# EAGLE design openfc (EAGLE 6.2)
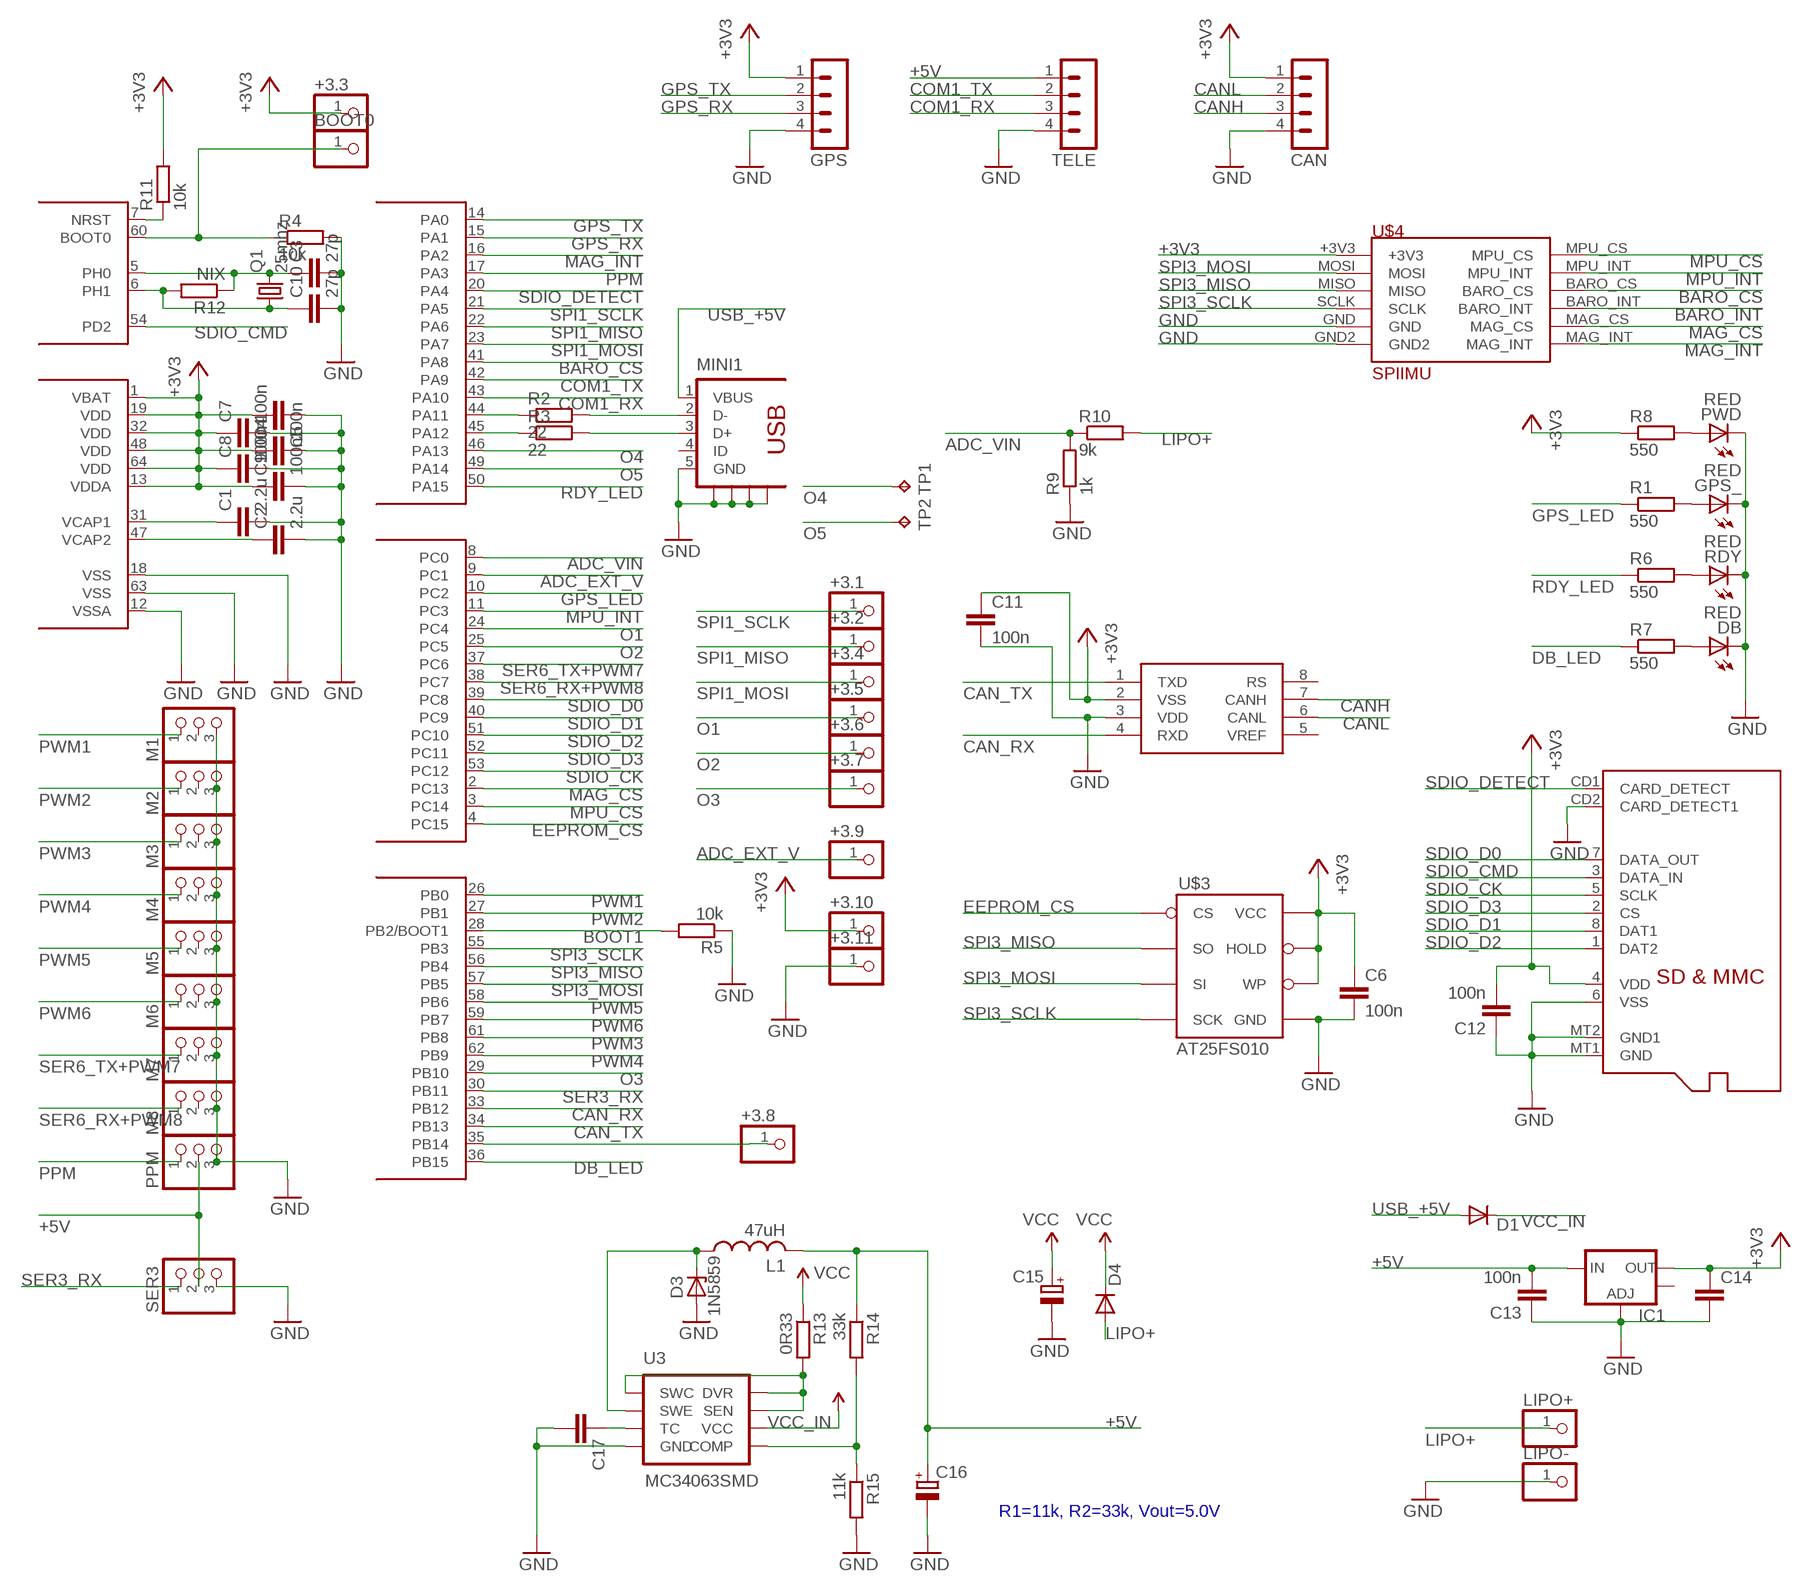
[diagram p0: schematic, sheet 1]

## Parts
+3.1  PINHD-1X1  [1X01]
+3.2  PINHD-1X1  [1X01]
+3.3  PINHD-1X1  [1X01]
+3.4  PINHD-1X1  [1X01]
+3.5  PINHD-1X1  [1X01]
+3.6  PINHD-1X1  [1X01]
+3.7  PINHD-1X1  [1X01]
+3.8  PINHD-1X1  [1X01]
+3.9  PINHD-1X1  [1X01]
+3.10  PINHD-1X1  [1X01]
+3.11  PINHD-1X1  [1X01]
BOOT0  PINHD-1X1  [1X01]
C1  2.2u  C-EUC0603  [C0603]
C2  2.2u  C-EUC0603  [C0603]
C3  27p  C-EUC0603  [C0603]
C4  100n  C-EUC0603  [C0603]
C5  100n  C-EUC0603  [C0603]
C6  100n  C-EUC0603  [C0603]
C7  100n  C-EUC0603  [C0603]
C8  100n  C-EUC0603  [C0603]
C9  100n  C-EUC0603  [C0603]
C10  27p  C-EUC0603  [C0603]
C11  100n  C-EUC0603  [C0603]
C12  100n  C-EUC0603  [C0603]
C13  100n  C-EUC0603  [C0603]
C14  C-EUC1206  [C1206]
C15  CPOL-EUB/3528-21R  [B/3528-21R]
C16  CPOL-EUB/3528-21R  [B/3528-21R]
C17  C-EUC0603  [C0603]
CAN  MA04-1  [MA04-1]
D1  DIODE-SMB  [SMB]
D3  1N5859  ZENER-DIODESMB  [SMB]
D4  DIODE-SMB  [SMB]
DB  RED  LED-RED0603  [LED-0603]
GPS  MA04-1  [MA04-1]
GPS_  RED  LED-RED0603  [LED-0603]
IC1  V_REG_LM1117SOT223  [SOT223]
L1  47uH  L-USL1812  [L1812]
LIPO+  PINHD-1X1  [1X01]
LIPO-  PINHD-1X1  [1X01]
M1  PINHD-1X3  [1X03]
M2  PINHD-1X3  [1X03]
M3  PINHD-1X3  [1X03]
M4  PINHD-1X3  [1X03]
M5  PINHD-1X3  [1X03]
M6  PINHD-1X3  [1X03]
M7  PINHD-1X3  [1X03]
M8  PINHD-1X3  [1X03]
MINI1  USB-5P  [USB-MINI-B]
PPM  PINHD-1X3  [1X03]
PWD  RED  LED-RED0603  [LED-0603]
Q1  25mhz  CRYSTALCTS406  [CTS406]
R1  550  R-EU_R0603  [R0603]
R2  22  R-EU_R0603  [R0603]
R3  22  R-EU_R0603  [R0603]
R4  10k  R-EU_R0603  [R0603]
R5  10k  R-EU_R0603  [R0603]
R6  550  R-EU_R0603  [R0603]
R7  550  R-EU_R0603  [R0603]
R8  550  R-EU_R0603  [R0603]
R9  1k  R-EU_R0603  [R0603]
R10  9k  R-EU_R0603  [R0603]
R11  10k  R-EU_R0603  [R0603]
R12  NIX  R-EU_R0603  [R0603]
R13  0R33  R-EU_R0603  [R0603]
R14  33k  R-EU_R0603  [R0603]
R15  11k  R-EU_R0603  [R0603]
RDY  RED  LED-RED0603  [LED-0603]
SER3  PINHD-1X3  [1X03]
TELE  MA04-1  [MA04-1]
TP1  TPTP14SQ  [TP14SQ]
TP2  TPTP14SQ  [TP14SQ]
U1  STM32F4-64  [SQFP-S-10X10-64]
U3  MC34063SMD  [SO08]
U4  MCP2551  [SO08]
U$2  MICROSD  [MICROSD]
U$3  AT25FS010  [SO08WIDE]
U$4  SPIIMU  [SPIIMU]

## Nets
+3V3: +3.3.1 +3.10.1 C4.1 C5.2 C6.1 C7.1 C8.1 C9.1 C11.1 C12.2 C14.1 CAN.1 GPS.1 IC1.2(OUT) R8.1 R11.2 U1.1(VBAT) U1.13(VDDA) U1.19(VDD) U1.32(VDD) U1.48(VDD) U1.64(VDD) U4.2(VSS) U$2.4(VDD) U$3.3(WP) U$3.7(HOLD) U$3.8(VCC) U$4.+3V3
+5V: C13.2 C16.+ IC1.3(IN) L1.2 PPM.2 R14.1 SER3.2 TELE.1
ADC_EXT_V: +3.9.1 U1.9(PC1)
ADC_VIN: R9.2 R10.1 U1.8(PC0)
BARO_CS: U1.41(PA8) U$4.BARO_CS
BARO_INT: U$4.BARO_INT
BOOT0: BOOT0.1 R4.1 U1.60(BOOT0)
BOOT1: R5.2 U1.28(PB2/BOOT1)
CAN_RX: U1.33(PB12) U4.4(RXD)
CAN_TX: U1.34(PB13) U4.1(TXD)
CANH: CAN.3 U4.7(CANH)
CANL: CAN.2 U4.6(CANL)
COM1_RX: TELE.3 U1.43(PA10)
COM1_TX: TELE.2 U1.42(PA9)
DB_LED: R7.1 U1.36(PB15)
EEPROM_CS: U1.4(PC15) U$3.1(CS)
GND: +3.11.1 C1.2 C2.2 C3.2 C4.2 C5.1 C6.2 C7.2 C8.2 C9.2 C10.2 C11.2 C12.1 C13.1 C14.2 C15.- C16.- C17.2 CAN.4 D3.A DB.C GPS.4 GPS_.C IC1.1(ADJ) LIPO-.1 M1.3 M2.3 M3.3 M4.3 M5.3 M6.3 M7.3 M8.3 MINI1.5(GND) MINI1.S1 MINI1.S2 MINI1.S3 MINI1.S4 PPM.3 PWD.C R4.2 R5.1 R9.1 R15.2 RDY.C SER3.3 TELE.4 U1.12(VSSA) U1.18(VSS) U1.63(VSS) U3.4(GND) U4.3(VDD) U$2.6(VSS) U$2.CD2(CARD_DETECT1) U$2.MT1(GND) U$2.MT2(GND1) U$3.4(GND) U$4.GND U$4.GND2
GPS_LED: R1.1 U1.10(PC2)
GPS_RX: GPS.3 U1.15(PA1)
GPS_TX: GPS.2 U1.14(PA0)
LIPO+: D4.A LIPO+.1 R10.2
MAG_CS: U1.2(PC13) U$4.MAG_CS
MAG_INT: U1.16(PA2) U$4.MAG_INT
MPU_CS: U1.3(PC14) U$4.MPU_CS
MPU_INT: U1.11(PC3) U$4.MPU_INT
N$1: C2.1 U1.47(VCAP2)
N$2: C1.1 U1.31(VCAP1)
N$3: R11.1 U1.7(NRST)
N$4: PWD.A R8.2
N$5: GPS_.A R1.2
N$6: R6.2 RDY.A
N$7: DB.A R7.2
N$8: +3.8.1 U1.35(PB14)
N$9: C3.1 Q1.3 R12.1 U1.5(PH0)
N$10: C10.1 Q1.1 R12.2 U1.6(PH1)
N$13: R2.1 U1.44(PA11)
N$14: R3.1 U1.45(PA12)
N$15: MINI1.2(D-) R2.2
N$16: MINI1.3(D+) R3.2
N$17: C17.1 U3.3(TC)
N$18: D3.C L1.1 U3.2(SWE)
N$19: R14.2 R15.1 U3.5(COMP)
N$20: R13.2 U3.1(SWC) U3.7(SEN) U3.8(DVR)
O1: +3.5.1 U1.24(PC4)
O2: +3.6.1 U1.25(PC5)
O3: +3.7.1 U1.29(PB10)
O4: TP1.TP U1.46(PA13)
O5: TP2.TP U1.49(PA14)
PPM: PPM.1 U1.17(PA3)
PWM1: M1.1 U1.26(PB0)
PWM2: M2.1 U1.27(PB1)
PWM3: M3.1 U1.61(PB8)
PWM4: M4.1 U1.62(PB9)
PWM5: M5.1 U1.58(PB6)
PWM6: M6.1 U1.59(PB7)
RDY_LED: R6.1 U1.50(PA15)
SDIO_CK: U1.53(PC12) U$2.5(SCLK)
SDIO_CMD: U1.54(PD2) U$2.3(DATA_IN)
SDIO_D0: U1.39(PC8) U$2.7(DATA_OUT)
SDIO_D1: U1.40(PC9) U$2.8(DAT1)
SDIO_D2: U1.51(PC10) U$2.1(DAT2)
SDIO_D3: U1.52(PC11) U$2.2(CS)
SDIO_DETECT: U1.20(PA4) U$2.CD1(CARD_DETECT)
SER3_RX: SER3.1 U1.30(PB11)
SER6_RX+PWM8: M8.1 U1.38(PC7)
SER6_TX+PWM7: M7.1 U1.37(PC6)
SPI1_MISO: +3.2.1 U1.22(PA6)
SPI1_MOSI: +3.4.1 U1.23(PA7)
SPI1_SCLK: +3.1.1 U1.21(PA5)
SPI3_MISO: U1.56(PB4) U$3.2(SO) U$4.MISO
SPI3_MOSI: U1.57(PB5) U$3.5(SI) U$4.MOSI
SPI3_SCLK: U1.55(PB3) U$3.6(SCK) U$4.SCLK
USB_+5V: D1.A MINI1.1(VBUS)
VCC_IN: C15.+ D1.C D4.C R13.1 U3.6(VCC) ; supply symbol labelled VCC
Unconnected: IC1.4(OUT) M1.2 M2.2 M3.2 M4.2 M5.2 M6.2 M7.2 M8.2 MINI1.4(ID) U4.5(VREF) U4.8(RS)

## Notes on the sheet
- R1=11k, R2=33k, Vout=5.0V

## Library data of the parts
+3.1-+3.11 BOOT0 LIPO+ LIPO- = adafruit:PINHD-1X1: Pin header 1x1 for 0.1" spacing With round pins
C1-C14 C17 = rcl:C-EU: CAPACITOR, European symbol
C15 C16 = rcl:CPOL-EU: POLARIZED CAPACITOR, European symbol
CAN GPS TELE = con-lstb:MA04-1: PIN HEADER; OC_FARNELL: unknown; OC_NEWARK: unknown
D1 D4 = diode:DIODE-: DIODE
D3 = diode:ZENER-DIODE: Z-Diode
DB GPS_ PWD RDY = SparkFun-LED:LED-RED: Assorted Red LEDs LilyPad 1206- DIO-09912 1206- DIO-00809 0603- DIO-00819; PROD_ID: DIO-00819
IC1 = SparkFun-PowerIC:V_REG_LM1117: Voltage Regulator LM1117 Standard adjustable voltage regulator but in SMD form. Spark Fun Electronics SKU : COM-00595
L1 = rcl:L-US: INDUCTOR, American symbol
M1-M8 PPM SER3 = adafruit:PINHD-1X3: PIN HEADER
MINI1 = BaseApp:USB-5P
Q1 = crystal:CRYSTAL: CRYSTAL; OC_FARNELL: unknown; OC_NEWARK: unknown
R1-R15 = resistor:R-EU_: RESISTOR, European symbol
TP1 TP2 = testpad:TP: Test pad
U1 = apbteam_stm32:STM32F4-64: STM32F4, 64 pin package According to STM32F40x datasheet, compatible with STM32F4xx, STM32F2xx. Also compatible with STM32F10x, if VCAP1 and VCAP2 are connected directly to VSS.
U3 = SparkFun:MC34063
U4 = SparkFun-DigitalIC:MCP2551: CAN transceiver
U$2 = adafruit:MICROSD: Micro-SD / Transflash card holder with SPI pinout For the 3M # 2908-05WB-MG and/or 4UCON #19656 push-push type
U$3 = SparkFun-DigitalIC:AT25FS010: 1-Mbit SPI flash memory
U$4 = spiimu:SPIIMU

## Board
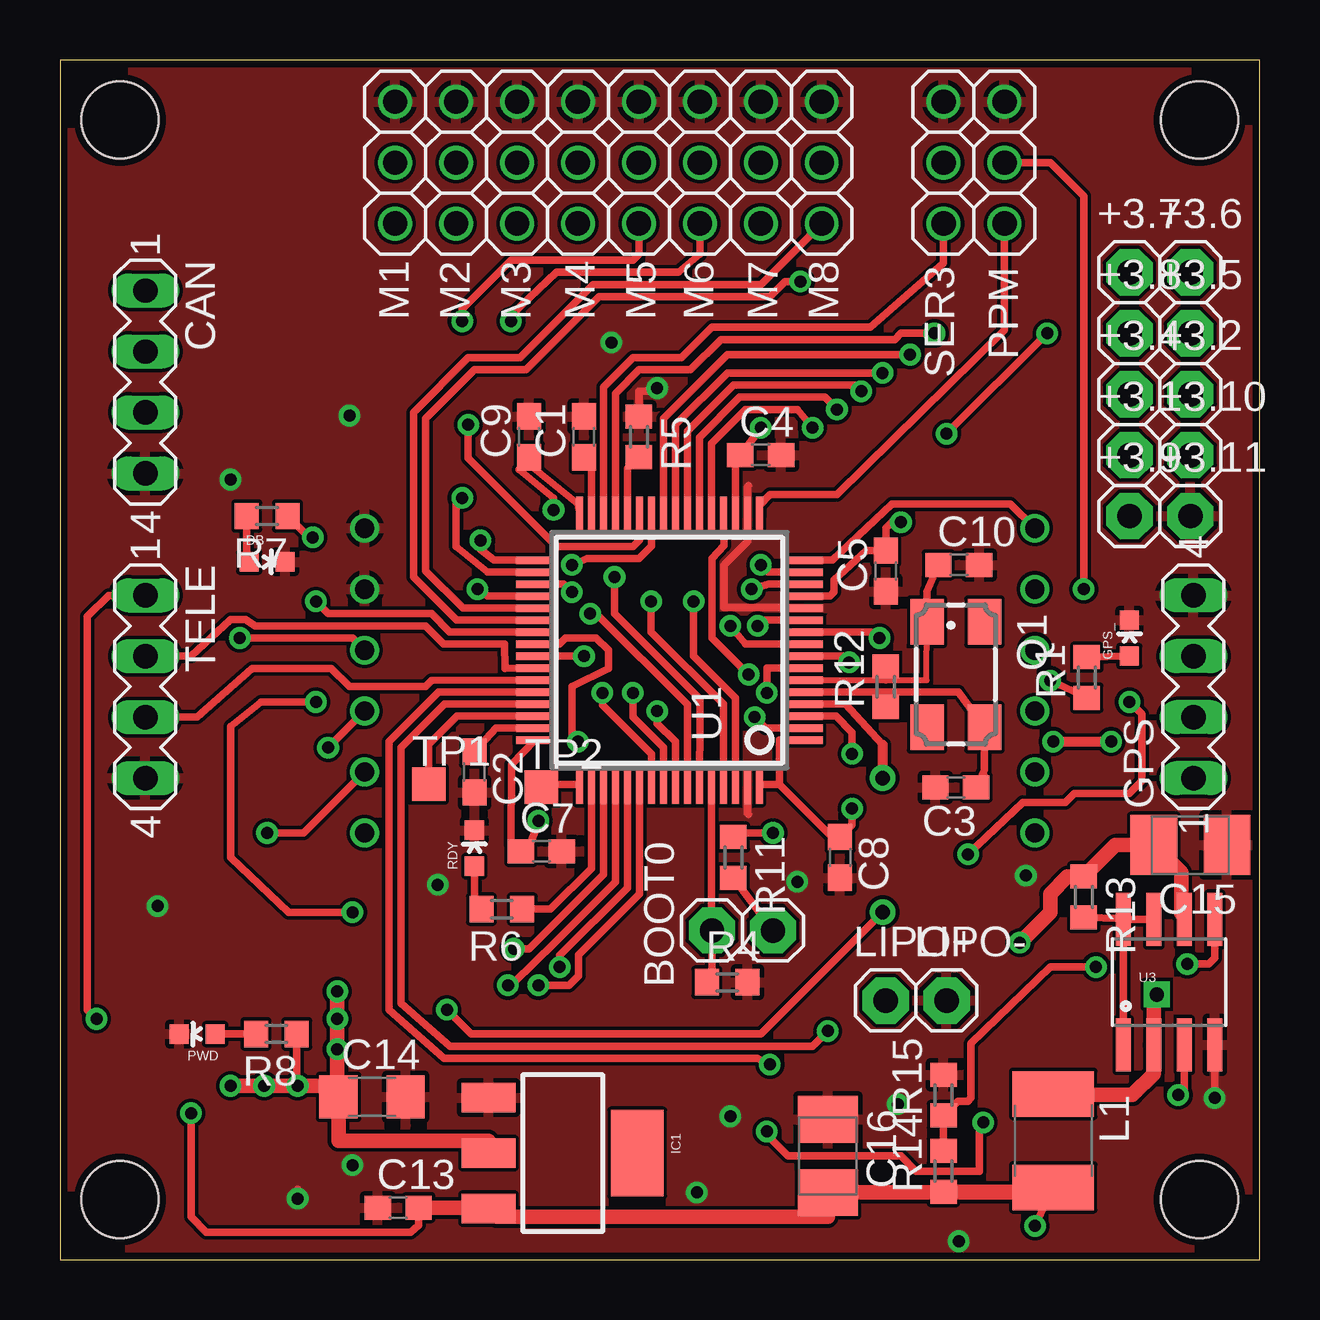
[diagram p1: board, top side]
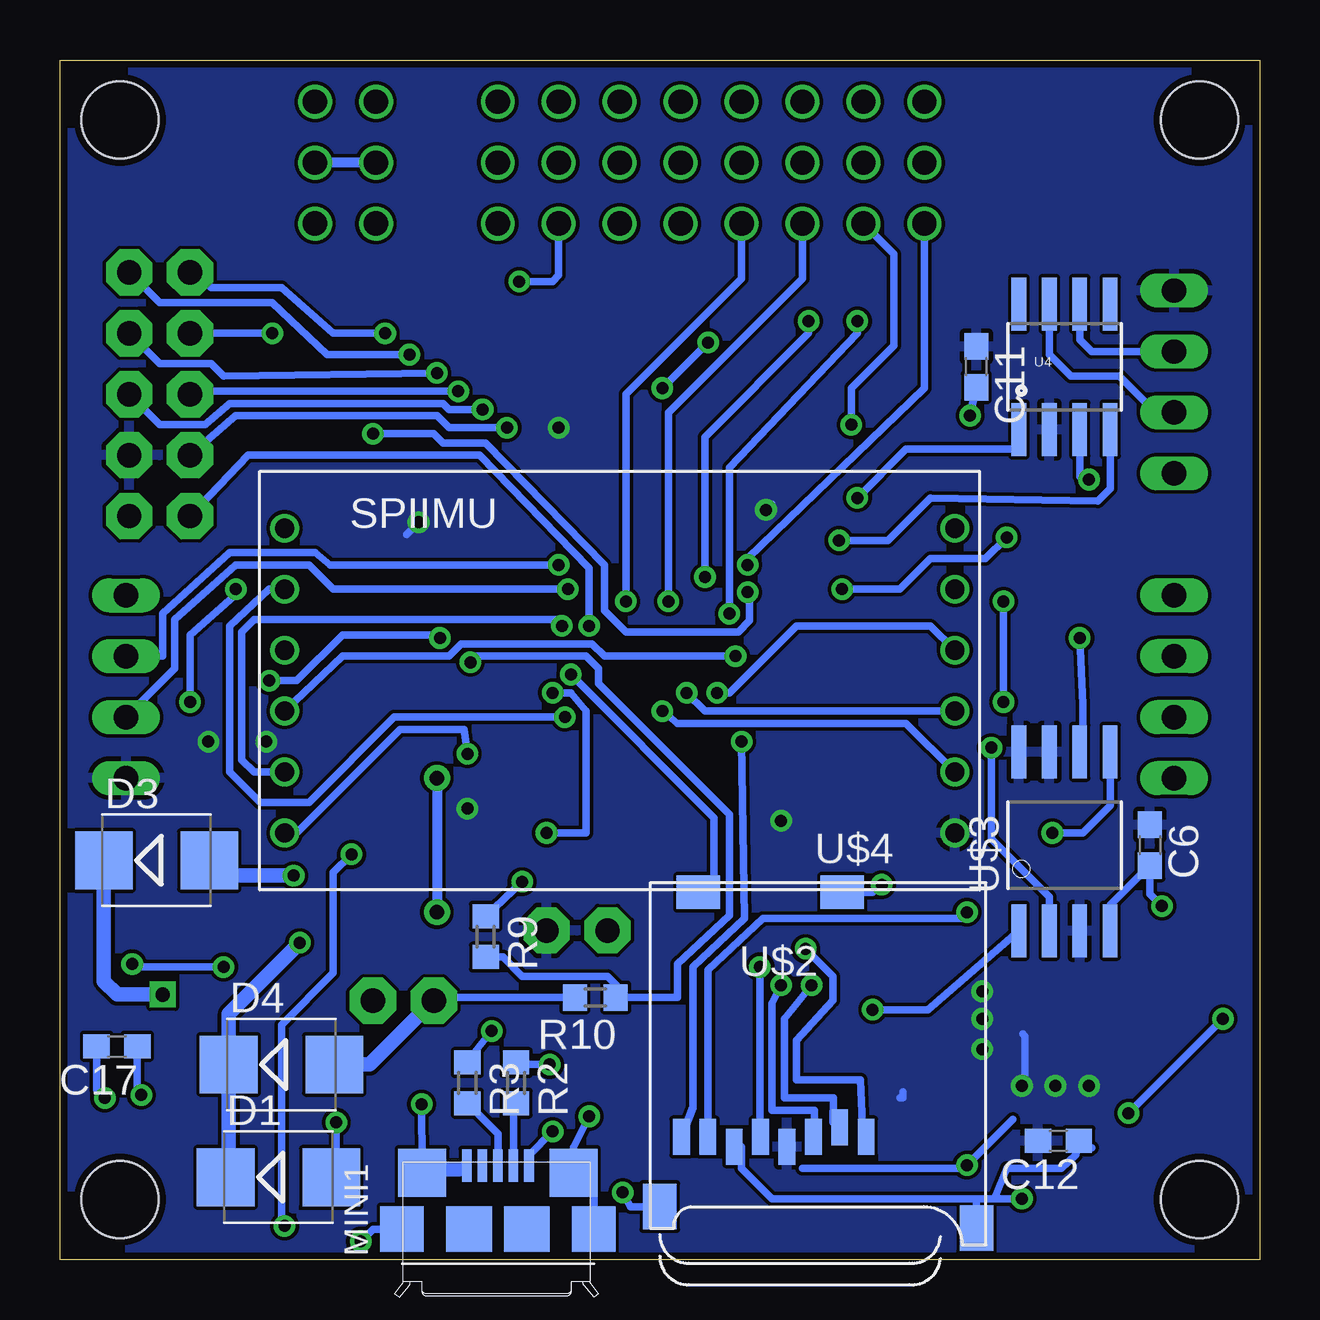
[diagram p2: board, bottom side, seen from below]

Size 50 x 50 mm. Coordinates in mm from the lower left corner, seen from the top.
Outline: 0,0 50,0 50,50 0,50 0,0
Copper layers (1*16): Top 0.035mm / dielectric 1.5mm / Bottom 0.035mm
Design rules: minimum track width 0.15mm, minimum drill 0.3mm, track to track 0.15mm, track to pad 0.15mm, pad to pad 0.15mm, via to via 0.15mm, smd to smd 0.15mm, copper to edge 0.3mm, drill to drill 0.2mm, minimum pad ring 0.2mm, minimum via ring 0.15mm, stop-mask expansion 0.075mm, vias tented up to drill 0mil, thermal gap 0.2mm
Holes 3.2 mm at 2.5,47.5 47.5,47.5 47.5,2.5 2.5,2.5

### Footprints (pad centres in the part's own frame; a part is rotated, then mirrored left to right if it is on the bottom)
1X01 = drill 1.016 pad 1.93 octagon: 1 0,0
C0603 = smd 1.1 x 1: 1 -0.85,0; 2 0.85,0
C1206 = smd 1.6 x 1.8: 1 -1.4,0; 2 1.4,0
B/3528-21R = smd 1.95 x 2.5: + 1.525,0; - -1.525,0
MA04-1 = drill 1.016 long: 1 -3.81,0; 2 -1.27,0; 3 1.27,0; 4 3.81,0
SMB = smd 2.4 x 2.4: A 2.2,0; C -2.2,0
LED-0603 = smd 0.8 x 0.8: A 0,-0.75; C 0,0.75
SOT223 = smd 1.219 x 2.235: 1 -2.311,-3.099; 2 0,-3.099; 3 2.311,-3.099 | smd 3.6 x 2.2: 4 0,3.099
L1812 = smd 1.9 x 3.4: 1 -1.95,0; 2 1.95,0
1X03 = drill 1.016: 1 -2.54,0; 2 0,0; 3 2.54,0
USB-MINI-B = smd 0.4 x 1.35: 1 1.3,2.65; 2 0.65,2.65; 3 0,2.65; 4 -0.65,2.65; 5 -1.3,2.65 | smd 1.9 x 1.9: M1 -1.2,0; M2 1.2,0 | smd 1.8 x 1.9: S1 -4,0; S2 4,0 | smd 2 x 2: S3 -3.15,2.35; S4 3.15,2.35
CTS406 = smd 1.9 x 1.4: 1 -2.2,-1.2; 2 2.2,-1.2; 3 2.2,1.2; 4 -2.2,1.2
R0603 = smd 1 x 1.1: 1 -0.85,0; 2 0.85,0
TP14SQ = smd 1.4 x 1.4: TP 0,0
SQFP-S-10X10-64 = smd 0.3 x 1.6: 1 -3.75,-5.6; 2 -3.25,-5.6; 3 -2.75,-5.6; 4 -2.25,-5.6; 5 -1.75,-5.6; 6 -1.25,-5.6; 7 -0.75,-5.6; 8 -0.25,-5.6; 9 0.25,-5.6; 10 0.75,-5.6; 11 1.25,-5.6; 12 1.75,-5.6; 13 2.25,-5.6; 14 2.75,-5.6; 15 3.25,-5.6; 16 3.75,-5.6; 33 3.75,5.6; 34 3.25,5.6; 35 2.75,5.6; 36 2.25,5.6; 37 1.75,5.6; 38 1.25,5.6; 39 0.75,5.6; 40 0.25,5.6; 41 -0.25,5.6; 42 -0.75,5.6; 43 -1.25,5.6; 44 -1.75,5.6; 45 -2.25,5.6; 46 -2.75,5.6; 47 -3.25,5.6; 48 -3.75,5.6 | smd 1.6 x 0.3: 17 5.6,-3.75; 18 5.6,-3.25; 19 5.6,-2.75; 20 5.6,-2.25; 21 5.6,-1.75; 22 5.6,-1.25; 23 5.6,-0.75; 24 5.6,-0.25; 25 5.6,0.25; 26 5.6,0.75; 27 5.6,1.25; 28 5.6,1.75; 29 5.6,2.25; 30 5.6,2.75; 31 5.6,3.25; 32 5.6,3.75; 49 -5.6,3.75; 50 -5.6,3.25; 51 -5.6,2.75; 52 -5.6,2.25; 53 -5.6,1.75; 54 -5.6,1.25; 55 -5.6,0.75; 56 -5.6,0.25; 57 -5.6,-0.25; 58 -5.6,-0.75; 59 -5.6,-1.25; 60 -5.6,-1.75; 61 -5.6,-2.25; 62 -5.6,-2.75; 63 -5.6,-3.25; 64 -5.6,-3.75
SO08 = smd 0.61 x 2.21: 1 -1.905,-2.616; 2 -0.635,-2.616; 3 0.635,-2.616; 4 1.905,-2.616; 5 1.905,2.616; 6 0.635,2.616; 7 -0.635,2.616; 8 -1.905,2.616
MICROSD = smd 0.7 x 1.5: 1 9,-10.64; 2 7.9,-10.24; 3 6.8,-10.64; 4 5.7,-11.04; 5 4.6,-10.64; 6 3.5,-11.04; 7 2.4,-10.64; 8 1.3,-10.64 | smd 1.8 x 1.4: CD1 2,-0.44; CD2 8,-0.44 | smd 1.4 x 1.9: MT1 0.4,-13.54; MT2 13.6,-14.44
SO08WIDE = smd 0.61 x 2.21: 1 -1.905,-3.569; 2 -0.635,-3.569; 3 0.635,-3.569; 4 1.905,-3.569; 5 1.905,3.886; 6 0.635,3.886; 7 -0.635,3.886; 8 -1.905,3.886
SPIIMU = drill 0.8: +3V3 -13.97,6.35; BARO_CS 13.97,1.27; BARO_INT 13.97,-1.27; GND -13.97,-3.81; GND2 -13.97,-6.35; MAG_CS 13.97,-3.81; MAG_INT 13.97,-6.35; MISO -13.97,1.27; MOSI -13.97,3.81; MPU_CS 13.97,6.35; MPU_INT 13.97,3.81; SCLK -13.97,-1.27

### Placement (x,y rotation side)
+3.1  44.58,33.53 0 top
+3.2  47.12,36.07 0 top
+3.3  29.72,13.72 270 top
+3.4  44.58,36.07 0 top
+3.5  47.12,38.61 0 top
+3.6  47.12,41.15 0 top
+3.7  44.58,41.15 0 top
+3.8  44.58,38.61 0 top
+3.9  44.58,30.99 0 top
+3.10  47.12,33.53 0 top
+3.11  47.12,30.99 0 top
BOOT0  27.18,13.72 90 top
C1  21.84,34.29 90 top
C2  17.27,20.32 270 top
C3  37.34,19.68 180 top
C4  29.21,33.53 0 top
C5  34.42,28.7 90 top
C6  4.57,17.27 270 bottom
C7  20.07,17.02 0 top
C8  32.51,16.76 270 top
C9  19.56,34.29 90 top
C10  37.47,28.96 0 top
C11  11.81,37.21 270 bottom
C12  8.38,4.95 180 bottom
C13  14.1,2.16 0 top
C14  13.01,6.78 0 top
C15  47.12,17.27 180 top
C16  32,4.32 270 top
C17  47.62,8.89 180 bottom
CAN  3.56,36.58 270 top
D1  40.89,3.43 0 bottom
D3  45.97,16.64 0 bottom
D4  40.77,8.13 0 bottom
DB  8.64,29.08 270 top
GPS  47.24,23.88 90 top
GPS_  44.58,25.91 0 top
IC1  20.96,4.44 270 top
L1  41.4,4.95 270 top
LIPO+  34.42,10.79 0 top
LIPO-  36.96,10.79 0 top
M1  13.97,45.72 90 top
M2  16.51,45.72 90 top
M3  19.05,45.72 90 top
M4  21.59,45.72 90 top
M5  24.13,45.72 90 top
M6  26.67,45.72 90 top
M7  29.21,45.72 90 top
M8  31.75,45.72 90 top
MINI1  31.75,1.27 0 bottom
PPM  39.37,45.72 90 top
PWD  5.71,9.4 90 top
Q1  37.34,24.38 270 top
R1  42.8,24.26 90 top
R2  30.99,7.37 270 bottom
R3  33.02,7.37 270 bottom
R4  27.81,11.56 0 top
R5  24.13,34.29 270 top
R6  18.41,14.61 180 top
R7  8.64,30.99 180 top
R8  9.02,9.4 180 top
R9  32.26,13.46 270 bottom
R10  27.69,10.92 180 bottom
R11  28.07,16.76 270 top
R12  34.42,23.88 90 top
R13  42.67,15.11 270 top
R14  36.83,3.68 90 top
R15  36.83,6.86 90 top
RDY  17.27,17.14 0 top
SER3  36.83,45.72 90 top
TELE  3.56,23.88 270 top
TP1  15.37,19.81 0 top
TP2  20.07,19.68 0 top
U1  25.4,25.4 90 top
U3  46.23,11.56 0 top
U4  8.13,37.21 0 bottom
U$2  25.4,15.75 0 bottom
U$3  8.13,17.27 0 bottom
U$4  26.67,24.13 180 bottom

### Tracks (layer width: path | path; a pad name or v marks a point on that pad's centre or on a via)
+3V3  (via drill 0.5)
  Top 0.305: U1.64 29.98,19.8 | 29.98,19.8 32.26,17.53 C8.1 33.02,18.12 v33.02,18.8 | U1.32 21.65,31.18 21.59,31.5 19.72,33.02 C9.1 19.14,32.93 20.57,31.75 v20.57,31.24 | 28.15,33.23 28.15,33.65 C4.1 28.03,33.53 | U1.48 18.82,20.63 18.8,17.27 19.05,17.02 C7.1 19.65,17.44 v19.94,18.29 | U1.19 28.15,33.23 | 28.15,33.23 28.19,33.27 v29.21,34.67 | U1.13 32.09,27.65 32.26,27.81 32.26,28.32 33.62,29.55 34.47,29.55 C5.2 34.42,30.48 34.67,30.73 v35.05,30.73 | R11.2 +3.3.1 | U1.1 29.98,21.65 29.98,19.8 | 11.68,6.86 11.56,6.99 11.3,7.24 v9.91,7.24 9.87,7.28 R8.1 9.91,9.36
  Top 0.406: v41.4,21.59 v43.81,21.59
  Top 0.61: IC1.2 17.86,4.95 11.61,4.95 C14.1 11.15,7.24 v7.11,7.24 | 11.56,11.05 11.56,6.99
  Bottom 0.305: v35.05,30.73 35.56,30.23 | v19.94,18.29 20.07,18.16 | v20.57,31.24 20.32,31.5 | 14.99,6.73 14.86,6.73 14.86,6.99 | v9.91,7.24 9.78,7.37 9.78,9.31 R8.1
  other vias: 8.51,7.24 11.56,8.76 11.56,10.03 11.56,11.18
  pour Bottom: -13.97,62.23 60.96,62.23 60.96,-24.13 -13.97,-24.13
+5V  (via drill 0.5)
  Top 0.305: PPM.2 41.27,45.72 42.67,44.32 v42.67,27.94 | v1.52,10.03 1.14,10.41 1.14,26.8 2.03,27.69 TELE.1 | 40.64,3.81 L1.2 | L1.2 40.47,2.83 | R14.1 36.79,2.79 | v44.58,23.24 45.09,22.73 45.09,19.94 44.58,19.43 42.29,19.43 41.91,19.05 40.13,19.05 v37.85,16.89 | v5.46,6.1 5.46,1.78 6.1,1.14 14.61,1.14 14.95,1.44 C13.2 | IC1.3 18.21,1.78 | 31.75,2.41 C16.+ | v40.64,1.4 L1.2
  Top 0.61: 18.21,1.78 32,1.78 C16.+ 40.47,2.79 40.47,2.83 | R14.1 41.4,2.83 L1.2 | C13.2 17.83,2.16 IC1.3
  Bottom 0.305: v42.67,27.94 42.55,27.81 44.58,26.04 v44.58,23.24 | v37.85,16.89 38.61,16.13 38.61,11.94 40.77,9.78 40.77,1.14 v40.64,1.4 | 1.52,10.16 v1.52,10.03 v5.46,6.1
  Bottom 0.406: SER3.2 PPM.2
ADC_EXT_V  (via drill 0.5)
  Top 0.305: U1.9 28.58,25.65 v27.94,26.42
  Bottom 0.305: v27.94,26.42 27.94,28.83 32.51,33.53 42.16,33.53 +3.9.1 44.45,31.11
ADC_VIN  (via drill 0.5)
  Top 0.305: U1.8 32.63,25.15 v32.89,24.89
  Bottom 0.305: v32.89,24.89 32.64,24.89 32.77,25.15 28.07,25.15 27.56,24.64 27.56,24 22.1,18.54 22.1,14.35 24.26,12.32 24.26,10.92 R10.1 26.8,11.43 27.18,11.81 30.73,11.81 31.54,12.61 R9.2
BARO_CS  (via drill 0.5)
  Top 0.305: U1.41 21.09,25.15 v21.84,25.15
  Bottom 0.305: v21.84,25.15 27.3,25.15 27.81,25.65 33.27,25.65 33.78,25.15 38.23,25.15 U$4.BARO_CS
BOOT0
  Top 0.305: U1.60 27.15,13.74 BOOT0.1 27.18,11.9 R4.1
BOOT1
  Top 0.305: U1.28 23.65,32.96 R5.2
CAN_RX  (via drill 0.5)
  Top 0.305: U1.33 18.09,29.15 17.53,29.59 v17.53,29.97
  Bottom 0.305: v17.53,29.97 15.49,29.97 13.72,31.75 6.73,31.62 6.22,32.13 U4.4
CAN_TX  (via drill 0.5)
  Top 0.305: U1.34 17.83,28.65 16.51,29.72 16.51,31.5 v16.76,31.75
  Bottom 0.305: v16.76,31.75 14.73,33.78 10.03,33.78 U4.1
CANH
  Bottom 0.305: CAN.3 4.32,35.31 5.84,36.83 7.87,36.83 8.76,37.72 U4.7
CANL
  Bottom 0.305: CAN.2 6.99,37.85 7.49,38.35 U4.6
COM1_RX
  Top 0.305: U1.43 15.49,24.13 15.24,23.88 12.06,23.88 11.3,24.64 8,24.64 5.71,22.61 TELE.3
COM1_TX
  Top 0.305: U1.42 18.54,24.64 18.53,25.67 15.99,25.67 15.24,26.42 8.13,26.42 7.75,26.67 7.11,26.67 5.46,25.15 TELE.2
DB_LED  (via drill 0.5)
  Top 0.305: U1.36 17.82,27.65 v17.4,27.94 | v10.54,30.1 10.38,30.1 R7.1
  Bottom 0.305: v17.4,27.94 14.99,27.94 13.72,29.21 11.43,29.21 v10.54,30.1
EEPROM_CS  (via drill 0.5, 0.6)
  Top 0.305: U1.4 32.73,23.15 34.29,21.46 | v34.29,14.48 34.16,14.35 29.21,9.4 17.14,9.4 v16.13,10.41
  Top 0.406: 34.29,21.46 v34.29,20.07 | v34.29,14.48 34.16,14.48 34.16,14.35
  Bottom 0.305: v16.13,10.41 13.83,10.41 U$3.1
  Bottom 0.406: v34.29,20.07 v34.29,14.48
GND  (via drill 0.5)
  Top 0.305: 28.7,32.26 28.65,32.21 U1.18 28.65,29.92 27.69,28.96 27.69,27.18 30.97,27.18 U1.12 | U1.63 28.65,18.59 28.7,18.54 | v27.94,5.97 27.81,6.1 | v34.92,6.48 35.18,6.6 | v4.06,14.73 4.06,14.48 | 12.19,3.81 v12.19,3.94 12.19,4.06 | v15.75,15.62 15.75,15.49 | v26.54,2.79 26.54,2.92 | 12.06,35.43 v12.06,35.18 | 7.11,32.77 v7.11,32.51 | 30.73,16 v30.73,15.75 | v40.26,16 40.51,16.13 | v9.91,2.54 9.91,2.92 | v48.13,6.73 U3.4 | R5.1 24.13,36.2 24.77,36.2 v24.89,36.32 | v22.99,38.23 22.99,38.1
  Bottom 0.305: MINI1.S3 33.35,3.62 MINI1.5 34.91,3.92 v34.92,6.48 | MINI1.S2 27.75,2.77 28.6,2.77 MINI1.S4 28.6,4.67 v27.94,5.97 | 24.92,1.78 U$2.MT1 26.21,2.21 v26.54,2.79 | U$3.4 6.22,14.77 C6.2 4.57,15.24 v4.06,14.73 | 11.05,2.54 10.54,3.81 8.26,3.81 7.66,4.36 C12.1 6.99,4.66 | 11.05,2.54 11.81,2.54 | 11.81,2.54 20.32,2.54 21.59,3.81 21.59,4.71 U$2.6 | 19.05,3.81 12.45,3.81 12.32,3.94 v12.19,3.94 10.29,5.84 | U$2.CD2 16.13,15.31 v15.75,15.62 | U$2.MT2 11.8,2.04 11.81,2.54 | MINI1.S1 36.96,1.27 v37.47,0.76 | C11.2 v12.06,35.18 | U4.3 7.49,32.64 v7.11,32.51 | R9.1 v30.73,15.75 | D3.A 43.39,16.26 | 11.05,2.54 v9.91,2.54 | C17.2 48.48,7.07 v48.13,6.73 | v24.89,36.32 v22.99,38.23
  Bottom 0.61: 43.39,16.26 43.43,16 v40.26,16
  pour Top: -11.43,59.69 53.85,59.82 53.85,-18.92 -11.43,-19.05
GPS_LED  (via drill 0.5)
  Top 0.305: U1.10 33.79,26.15 v34.16,25.91 | v41.27,24.13 42.84,23.41 R1.1
  Bottom 0.305: v34.16,25.91 34.54,26.04 38.23,26.04 40.13,24.13 v41.27,24.13
GPS_RX  (via drill 0.5)
  Top 0.305: U1.15 29.52,28.65 v29.21,28.96
  Bottom 0.305: v29.21,28.96 38.73,28.96 39.37,29.46 42.93,29.46 45.72,26.92 45.72,25.15 GPS.3
GPS_TX  (via drill 0.5)
  Top 0.305: U1.14 29.55,28.15 v28.83,27.94
  Bottom 0.305: v28.83,27.94 38.61,27.94 39.62,28.96 42.67,28.96 45.21,26.67 45.21,24.64 GPS.2
LIPO+
  Bottom 0.305: R10.2 34.67,10.92 LIPO+.1
  Bottom 0.61: D4.A 37.08,8.13 LIPO+.1
MAG_CS  (via drill 0.5)
  Top 0.305: U1.2 29.41,22.15 v28.96,22.61
  Bottom 0.305: v28.96,22.61 36.07,22.61 39.62,19.05 41.66,19.05 42.93,20.32 42.93,26.42 41.27,27.94 U$4.MAG_CS
MAG_INT
  Top 0.305: U1.16 32.2,29.15 34.67,31.5 39.62,31.5 U$4.MAG_INT
MPU_CS  (via drill 0.5)
  Top 0.305: U1.3 32.34,22.65 33.02,21.97 v33.02,21.08
  Bottom 0.305: v33.02,21.08 33.15,22.1 35.81,22.1 40.13,17.78 U$4.MPU_CS
MPU_INT  (via drill 0.5)
  Top 0.305: U1.11 29.34,26.65 v29.08,26.42
  Bottom 0.305: v29.08,26.42 29.08,26.67 41.91,26.67 42.42,26.16 42.42,20.83 41.91,20.32 U$4.MPU_INT
N$1
  Top 0.305: U1.47 18.17,22.15 C2.1
N$2
  Top 0.305: U1.31 22.15,33.64 C1.1
N$3  (via drill 0.5)
  Top 0.305: U1.7 29.46,24.65 v29.46,23.62 | v29.72,17.78 28.36,17.78 R11.1
  Bottom 0.305: v29.46,23.62 28.7,23.62 28.07,22.86 28.07,17.78 v29.72,17.78
N$4
  Top 0.305: PWD.A R8.2
N$5
  Top 0.305: R1.2 GPS_.A
N$6
  Top 0.305: RDY.A 17.27,14.9 R6.2
N$7
  Top 0.305: R7.2 7.79,29.18 DB.A
N$8  (via drill 0.5)
  Top 0.305: U1.35 21,28.15 v21.34,27.81 | v36.96,34.42 v41.15,38.61
  Bottom 0.305: 21.21,27.69 v21.34,27.81 21.25,27.73 21.25,26.63 21.72,26.16 26.42,26.16 27.3,27.05 27.3,28.96 32.26,34.04 34.04,34.04 34.42,34.42 v36.96,34.42 | v41.15,38.61 +3.8.1
N$9
  Top 0.305: 38.54,20.16 C3.1 38.54,20.42 Q1.3 37.45,23.65 34.67,23.65 | U1.5 34.67,23.65 | R12.1 34.67,23.03 34.67,23.65
N$10
  Top 0.254: U1.6 34.42,24.15 36.12,24.15 Q1.1
  Top 0.305: Q1.1 36.14,27.84 C10.1 | R12.2 34.42,24.15
N$13  (via drill 0.5)
  Top 0.305: U1.44 15.78,23.65 13.72,21.59 13.72,10.41 16,8.38 29.08,8.38 v29.59,8.13
  Bottom 0.305: v29.59,8.13 30.9,8.13 R2.1
N$14  (via drill 0.5)
  Top 0.305: U1.45 16.04,23.15 14.22,21.34 14.22,10.67 16.26,8.89 31.37,8.89 v32,9.53
  Bottom 0.305: v32,9.53 33.11,8.13 R3.1
N$15
  Bottom 0.305: MINI1.2 31.1,6.4 R2.2
N$16
  Bottom 0.305: MINI1.3 31.75,5.25 R3.2
N$17  (via drill 0.5)
  Top 0.305: 46.77,9.07 U3.3 46.86,6.99 v46.61,6.86
  Bottom 0.305: C17.1 46.77,6.9 v46.61,6.86
N$18  (via drill 0.6)
  Top 0.61: L1.1 41.45,6.86 44.7,6.86 45.59,7.75 U3.2 45.59,10.67 45.72,10.79 v45.72,11.05
  Bottom 0.61: D3.C 48.17,11.6 47.62,11.05 v45.72,11.05
N$19  (via drill 0.5)
  Top 0.305: U3.5 48.13,12.57 47.88,12.32 v46.99,12.32 | R14.2 R15.1 37.43,6.6 37.85,6.6 37.97,6.73 37.97,9.02 41.27,12.19 v43.18,12.19
  Bottom 0.305: v46.99,12.32 46.86,12.19 v43.18,12.19
N$20
  Top 0.305: U3.7 U3.8 | U3.8 U3.1 | U3.8 44.25,14.22 R13.2
O1  (via drill 0.5)
  Top 0.305: U1.24 25.65,34.79 27.81,36.96 v34.29,36.96
  Bottom 0.305: v34.29,36.96 43.18,36.83 43.69,37.34 45.85,37.34 +3.5.1
O2  (via drill 0.5)
  Top 0.305: U1.25 25.15,35.06 27.81,37.72 v35.43,37.72
  Bottom 0.305: v35.43,37.72 38.86,37.72 41.15,39.88 45.85,39.88 +3.6.1
O3  (via drill 0.5)
  Top 0.305: U1.29 23.15,36.1 24.13,37.08 26.29,37.08 27.56,38.35 34.8,38.35 35.05,38.61 v36.45,38.61
  Bottom 0.305: v36.45,38.61 38.61,38.61 40.77,40.51 43.69,40.51 44.32,41.15 +3.7.1
O4
  Top 0.305: U1.46 16.55,22.65 15.37,21.46 TP1.TP
O5
  Top 0.305: U1.49 20.33,19.8 TP2.TP
PPM
  Top 0.305: U1.17 29.15,31.44 29.59,31.88 32.38,31.88 39.37,38.73 PPM.1
PWM1  (via drill 0.5)
  Top 0.305: U1.26 24.65,29.73 24.13,29.21 21.97,29.21 v21.34,28.96
  Bottom 0.305: v21.34,28.96 21.34,29.21 13.97,36.32 M1.1
PWM2  (via drill 0.5)
  Top 0.305: U1.27 24.15,29.99 23.88,29.72 20.7,29.72 17.02,33.4 v17.02,34.8
  Bottom 0.305: v17.02,34.8 17.02,36.32 15.24,38.1 15.24,41.91 M2.1
PWM3  (via drill 0.5)
  Top 0.305: U1.61 27.65,23.15 24.64,26.16 v24.64,27.43
  Bottom 0.305: v24.64,27.43 24.64,35.31 19.05,40.89 M3.1
PWM4  (via drill 0.5)
  Top 0.305: U1.62 28.15,23.41 26.42,25.15 v26.42,27.43
  Bottom 0.305: v26.42,27.43 26.42,36.07 21.59,40.89 M4.1
PWM5  (via drill 0.5)
  Top 0.305: U1.58 26.15,23.13 22.35,26.92 v22.1,26.92 | v16.76,39.12 16.76,39.62 18.8,41.66 23.88,41.66 24.13,41.91 M5.1
  Bottom 0.305: v22.1,26.92 22.1,33.02 16.76,38.61 v16.76,39.12
PWM6  (via drill 0.5)
  Top 0.305: U1.59 26.65,21.06 26.67,21.34 26.67,23.37 23.11,26.92 v23.11,28.45 | v18.8,39.12 18.8,39.37 20.7,41.15 25.78,41.15 26.67,41.91 M6.1
  Bottom 0.305: v23.11,28.45 23.11,34.29 18.8,38.61 v18.8,39.12
RDY_LED
  Top 0.305: U1.50 22.15,16.31 20.45,14.61 R6.1
SDIO_CK  (via drill 0.5)
  Top 0.305: U1.53 23.65,15.49 20.83,12.67 v20.83,12.19
  Bottom 0.305: v20.83,12.19 20.83,4.63 U$2.5
SDIO_CMD  (via drill 0.5)
  Top 0.305: U1.54 24.15,15.24 21.61,12.7 21.61,11.83 21.21,11.43 v19.94,11.43
  Bottom 0.305: v19.94,11.43 20.32,10.67 20.32,6.22 18.54,6.22 18.54,4.8 U$2.3
SDIO_D0  (via drill 0.5)
  Top 0.305: U1.39 16.24,26.15 15.49,26.92 11.18,26.92 v10.67,27.43 | v10.67,23.24 8.38,23.24 7.11,22.23 7.11,16.76 9.53,14.48 v12.19,14.48
  Bottom 0.305: v10.67,27.43 v10.67,23.24 | v12.19,14.48 12.32,14.22 20.7,14.22 22.99,12.06 22.99,4.84 U$2.7
SDIO_D1  (via drill 0.5)
  Top 0.305: U1.40 20.82,25.65 21.08,25.91 22.35,25.91 22.86,25.4 22.86,24.64 21.34,23.88 21.34,21.84 v21.59,21.59
  Bottom 0.305: v21.59,21.59 21.46,14.22 23.62,12.19 23.62,6.35 U$2.8
SDIO_D2  (via drill 0.5)
  Top 0.305: U1.51 22.65,16.05 19.56,12.95 v18.92,12.95
  Bottom 0.305: v18.92,12.95 17.78,11.81 17.78,10.79 19.3,9.14 19.3,7.49 16.64,7.49 16.51,4.74 U$2.1
SDIO_D3  (via drill 0.5)
  Top 0.305: U1.52 23.15,15.75 20.61,13.21 18.92,11.56 v18.67,11.43
  Bottom 0.305: v18.67,11.43 19.81,10.03 19.81,6.73 17.75,6.73 17.78,5.71 17.57,5.51 U$2.2
SDIO_DETECT  (via drill 0.5)
  Top 0.305: U1.20 27.69,29.77 27.18,29.21 27.18,25.91 v28.7,24.38
  Bottom 0.305: v28.7,24.38 22.73,18.41 22.73,15.78 U$2.CD1
SER3_RX
  Top 0.305: U1.30 22.65,36.37 23.88,37.59 25.91,37.59 27.18,38.86 33.78,38.86 36.83,41.53 SER3.1
SER6_RX+PWM8
  Top 0.305: U1.38 16.53,26.65 14.73,28.45 14.73,35.31 17.02,37.59 19.18,37.59 22.23,40.64 29.21,40.64 M8.1
SER6_TX+PWM7  (via drill 0.5)
  Top 0.305: U1.37 16.79,27.15 15.24,28.7 15.24,35.05 17.27,37.08 19.43,37.08 22.48,40.13 29.59,40.13 30.23,40.77 v30.86,40.77
  Bottom 0.305: v30.86,40.77 29.46,40.77 29.21,41.02 M7.1
SPI1_MISO  (via drill 0.5)
  Top 0.305: U1.22 26.65,34.27 28.32,35.94 31.88,35.94 v32.38,35.43
  Bottom 0.305: v32.38,35.43 33.78,35.43 34.04,35.69 42.93,35.69 43.94,34.8 45.85,34.8 +3.2.1
SPI1_MOSI  (via drill 0.5)
  Top 0.305: U1.23 26.15,34.53 28.07,36.45 33.15,36.45 v33.4,36.2
  Bottom 0.305: v33.4,36.2 44.58,36.2 +3.4.1
SPI1_SCLK  (via drill 0.5)
  Top 0.305: U1.21 27.15,34.01 28.57,35.43 30.73,35.43 v31.37,34.67
  Bottom 0.305: v31.37,34.67 33.78,34.67 34.29,35.18 42.67,35.18 +3.1.1
SPI3_MISO  (via drill 0.5)
  Top 0.305: U1.56 25.15,21.34 23.88,22.61 v23.88,23.62 | v11.18,21.34 U$4.MISO
  Bottom 0.305: v23.88,23.62 23.11,22.86 U$4.MISO | U$3.2 8.76,15.11 11.18,17.53 v11.18,21.34
SPI3_MOSI  (via drill 0.5)
  Top 0.305: U1.57 25.65,21.59 24.89,22.35 v24.89,22.86 | v8.64,17.78 10.16,17.78 U$4.MOSI
  Bottom 0.305: v24.89,22.86 24.26,22.35 14.73,22.35 U$4.MOSI | U$3.5 6.22,18.92 7.37,17.78 v8.64,17.78
SPI3_SCLK  (via drill 0.5)
  Top 0.305: U1.55 24.65,21.07 22.61,23.11 v22.61,23.62 | U$4.SCLK 12.19,25.91 v7.49,25.91
  Bottom 0.305: v22.61,23.62 22.1,23.62 19.3,26.42 13.72,26.42 U$4.SCLK | v7.49,25.91 7.37,23.11 7.37,21.29 U$3.6
USB_+5V  (via drill 0.5)
  Top 0.305: v29.46,5.33 29.46,5.21 30.35,4.32 35.05,4.32 35.69,3.68 38.31,3.68 38.31,5.42 v38.48,5.71
  Bottom 0.305: MINI1.1 30.45,4.35 v29.46,5.33 | v38.48,5.71 38.48,3.52 D1.A
VCC_IN  (via drill 0.5)
  Top 0.305: U3.6 46.74,14.43
  Top 0.61: v40.01,13.21 41.27,14.48 41.27,15.24 42,15.96 R13.1 43.98,17.27 C15.+ 46.74,16.13 46.74,14.43
  Bottom 0.305: D4.C 42.97,8.85
  Bottom 0.61: D4.C 42.97,3.56 D1.C | 42.97,8.85 42.97,10.25 v40.01,13.21